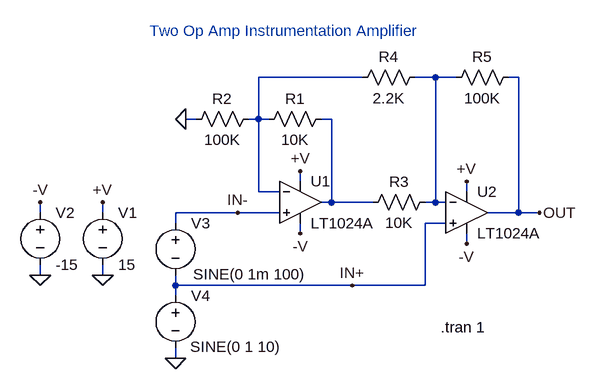
[diagram p0: schematic 1024A.asc]
1024A.asc, the LTspice schematic file:
Version 4
SHEET 1 896 680
WIRE 288 48 128 48
WIRE 400 48 368 48
WIRE 432 48 400 48
WIRE 528 48 512 48
WIRE 32 112 16 112
WIRE 128 112 128 48
WIRE 128 112 112 112
WIRE 144 112 128 112
WIRE 240 112 224 112
WIRE 192 208 192 192
WIRE 128 224 128 112
WIRE 160 224 128 224
WIRE 448 224 448 208
WIRE 240 240 240 112
WIRE 240 240 224 240
WIRE 304 240 240 240
WIRE 400 240 400 48
WIRE 400 240 384 240
WIRE 416 240 400 240
WIRE -208 256 -208 240
WIRE -112 256 -112 240
WIRE 96 256 0 256
WIRE 160 256 96 256
WIRE 528 256 528 48
WIRE 528 256 480 256
WIRE 560 256 528 256
WIRE 0 272 0 256
WIRE 416 272 384 272
WIRE 192 288 192 272
WIRE 448 304 448 288
WIRE -208 352 -208 336
WIRE -112 352 -112 336
WIRE 0 368 0 352
WIRE 272 368 0 368
WIRE 384 368 384 272
WIRE 384 368 272 368
WIRE 0 384 0 368
WIRE 0 480 0 464
FLAG -112 352 0
FLAG 192 192 +V
FLAG -112 240 +V
FLAG 192 288 -V
FLAG -208 352 0
FLAG -208 240 -V
FLAG 16 112 0
FLAG 448 208 +V
FLAG 448 304 -V
FLAG 0 480 0
FLAG 96 256 IN-
FLAG 272 368 IN+
FLAG 560 256 OUT
SYMBOL voltage -112 240 R0
SYMATTR InstName V1
SYMATTR Value 15
SYMBOL voltage -208 240 R0
SYMATTR InstName V2
SYMATTR Value -15
SYMBOL res 240 96 R90
WINDOW 0 0 56 VBottom 2
WINDOW 3 32 56 VTop 2
SYMATTR InstName R1
SYMATTR Value 10K
SYMBOL res 128 96 R90
WINDOW 0 0 56 VBottom 2
WINDOW 3 32 56 VTop 2
SYMATTR InstName R2
SYMATTR Value 100K
SYMBOL voltage 0 256 R0
WINDOW 3 27 95 Left 2
SYMATTR Value SINE(0 1m 100)
SYMATTR InstName V3
SYMBOL res 400 224 R90
WINDOW 0 0 56 VBottom 2
WINDOW 3 32 56 VTop 2
SYMATTR InstName R3
SYMATTR Value 10K
SYMBOL res 384 32 R90
WINDOW 0 0 56 VBottom 2
WINDOW 3 32 56 VTop 2
SYMATTR InstName R4
SYMATTR Value 2.2K
SYMBOL res 528 32 R90
WINDOW 0 0 56 VBottom 2
WINDOW 3 32 56 VTop 2
SYMATTR InstName R5
SYMATTR Value 100K
SYMBOL voltage 0 368 R0
WINDOW 3 23 94 Left 2
SYMATTR Value SINE(0 1 10)
SYMATTR InstName V4
SYMBOL opamps\\LT1024A 192 176 R0
SYMATTR InstName U1
SYMBOL opamps\\LT1024A 448 192 R0
SYMATTR InstName U2
TEXT 408 432 Left 2 !.tran 1
TEXT 168 -8 Bottom 2 ;Two Op Amp Instrumentation Amplifier

The netlist it stands for:
* 1024A.asc
V1 +V 0 15
V2 -V 0 -15
R1 N003 N001 10K
R2 N001 0 100K
V3 IN- IN+ SINE(0 1m 100)
R3 N002 N003 10K
R4 N002 N001 2.2K
R5 OUT N002 100K
V4 IN+ 0 SINE(0 1 10)
XU1 IN- N001 +V -V N003 LT1024A  ; pins In+ In- V+ V- OUT
XU2 IN+ N002 +V -V OUT LT1024A  ; pins In+ In- V+ V- OUT
.tran 1
* Two Op Amp Instrumentation Amplifier
.backanno
.end